# EAGLE design tello-charger (EAGLE 9.6.2)
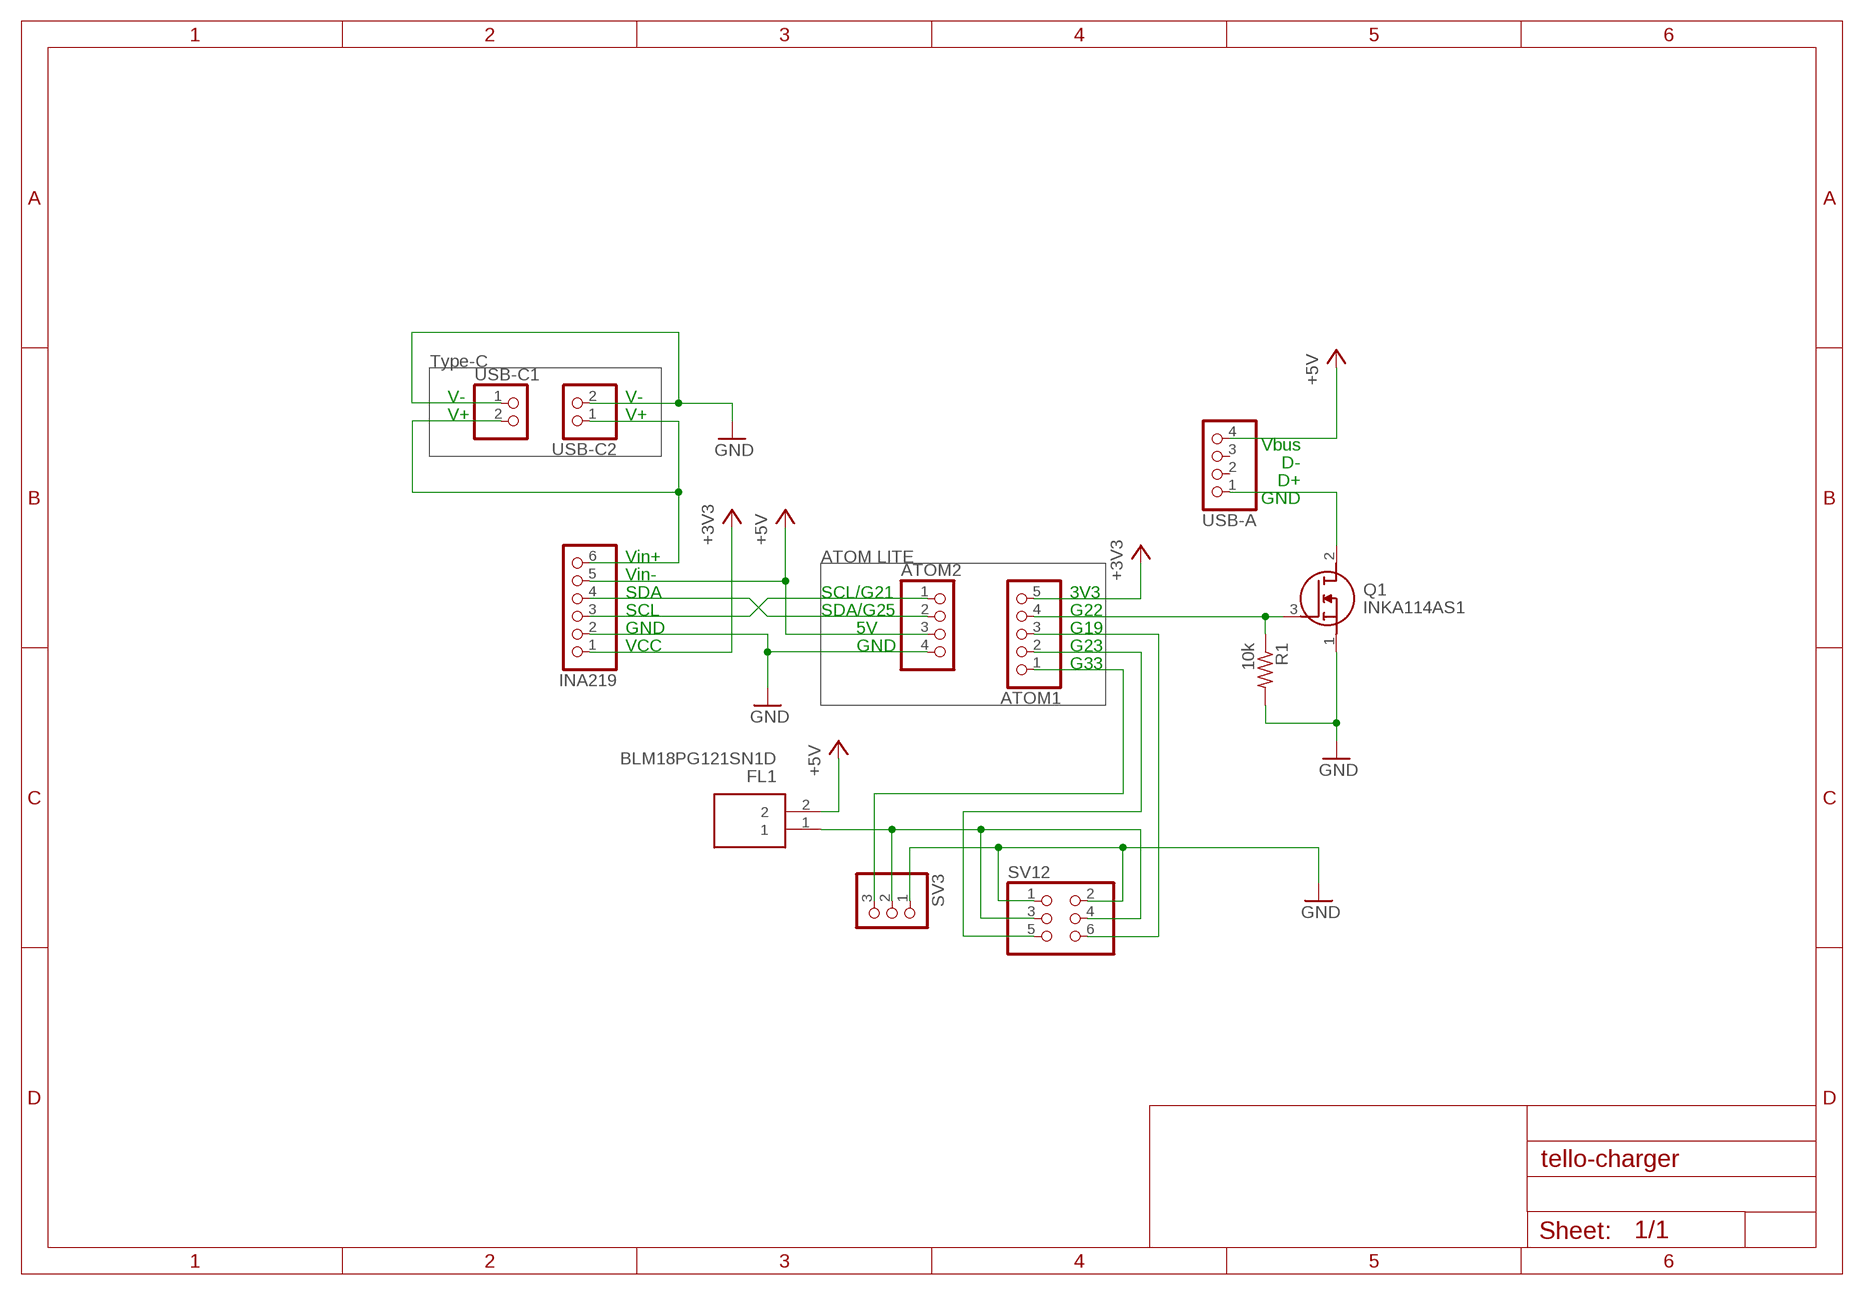
[diagram p0: schematic, sheet 1]

## Parts
ATOM1  PINHD-1X5  [1X05]
ATOM2  PINHD-1X4  [1X04]
FL1  BLM18PG121SN1D  [BLM18AG102BH1D]
INA219  PINHD-1X6  [1X06]
Q1  INKA114AS1  [INKA114AS1]
R1  10k  R-US_R0603  [R0603]
SV3  PINHD-1X3/90  [1X03/90]
SV12  PINHD-2X3/90  [2X03/90]
USB-A  PINHD-1X4  [1X04]
USB-C1  PINHD-1X2  [1X02]
USB-C2  PINHD-1X2  [1X02]

## Nets
+3V3 [POWER]: ATOM1.5 INA219.1
+5V [POWER]: ATOM2.3 FL1.2 INA219.5 USB-A.4
GND [POWER]: ATOM2.4 INA219.2 Q1.1(S) R1.2 SV3.1 SV12.1 SV12.2 USB-C1.1 USB-C2.2
N$1: INA219.6 USB-C1.2 USB-C2.1
N$2: Q1.2(D) USB-A.1
N$3: ATOM2.2 INA219.4
N$4: ATOM2.1 INA219.3
N$5: ATOM1.2 SV12.5
N$6: ATOM1.4 Q1.3(G) R1.1
N$7: FL1.1 SV3.2 SV12.3 SV12.4
N$8: ATOM1.3 SV12.6
N$9: ATOM1.1 SV3.3
Unconnected: USB-A.2 USB-A.3

## Notes on the sheet
- Type-C
- V- | V-
- V+ | V+
- Vbus
- D-
- D+
- GND
- Vin+ | ATOM LITE
- Vin-
- SDA | SCL/G21 | 3V3
- SCL | SDA/G25 | G22
- GND | 5V | G19
- VCC | GND | G23
- G33

## Library data of the parts
ATOM1 = pinhead:PINHD-1X5: PIN HEADER
ATOM2 USB-A = pinhead:PINHD-1X4: PIN HEADER
FL1 = SamacSys_Parts:BLM18PG121SN1D: Ferrite bead SMD 0603 120R 2A Murata Ferrite Bead (Chip Ferrite Bead), 1.6 x 0.8 x 0.8mm (0603), 120 impedance at 100 MHz Source: Datasheet <https://www.murata.com/en-us/products/productdetail?partno=BLM18PG121SN1#>; ARROW_PART_NUMBER: BLM18PG121SN1D; ARROW_PRICE-STOCK: https://www.arrow.com/en/products/blm18pg121sn1d/murata-manufacturing?region=nac; DESCRIPTION: Ferrite bead SMD 0603 120R 2A Murata Ferrite Bead (Chip Ferrite Bead), 1.6 x 0.8 x 0.8mm (0603), 120 impedance at 100 MHz; HEIGHT: 0.95mm; MANUFACTURER_NAME: Murata Electronics; MANUFACTURER_PART_NUMBER: BLM18PG121SN1D; MOUSER_PART_NUMBER: 81-BLM18PG121SN1D; MOUSER_PRICE-STOCK: https://www.mouser.co.uk/ProductDetail/Murata-Electronics/BLM18PG121SN1D?qs=tY8e8KZalarVxhnmnUYZ1A%3D%3D
INA219 = pinhead:PINHD-1X6: PIN HEADER
Q1 = SamacSys_Parts:INKA114AS1: Active clamp, Silicon N channel MOS type Source: Datasheet <https://www.idc-com.co.jp/product/Search/Pdf/en/8/INKA114AS1/0/>; DESCRIPTION: Active clamp, Silicon N channel MOS type; HEIGHT: 3mm; MANUFACTURER_NAME: ISAHAYA ELECTRONICS CORPORATION; MANUFACTURER_PART_NUMBER: INKA114AS1
R1 = rcl:R-US_: RESISTOR, American symbol; SPICEPREFIX: R
SV3 = pinhead:PINHD-1X3: PIN HEADER
SV12 = pinhead:PINHD-2X3: PIN HEADER
USB-C1 USB-C2 = pinhead:PINHD-1X2: PIN HEADER

## Net classes
1 POWER: width 0.508 mm

## Board
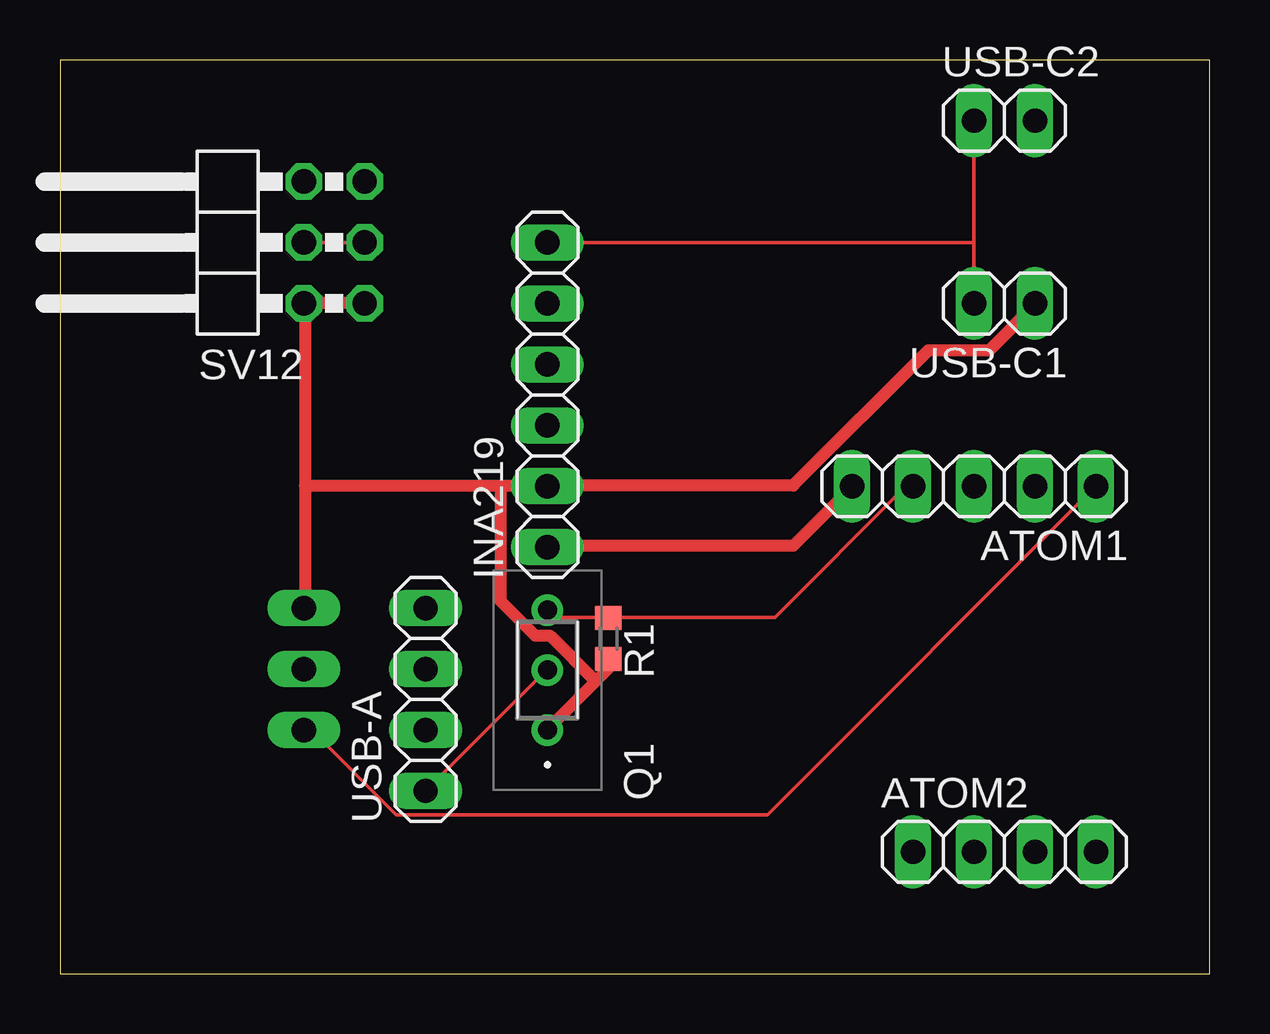
[diagram p1: board, top side]
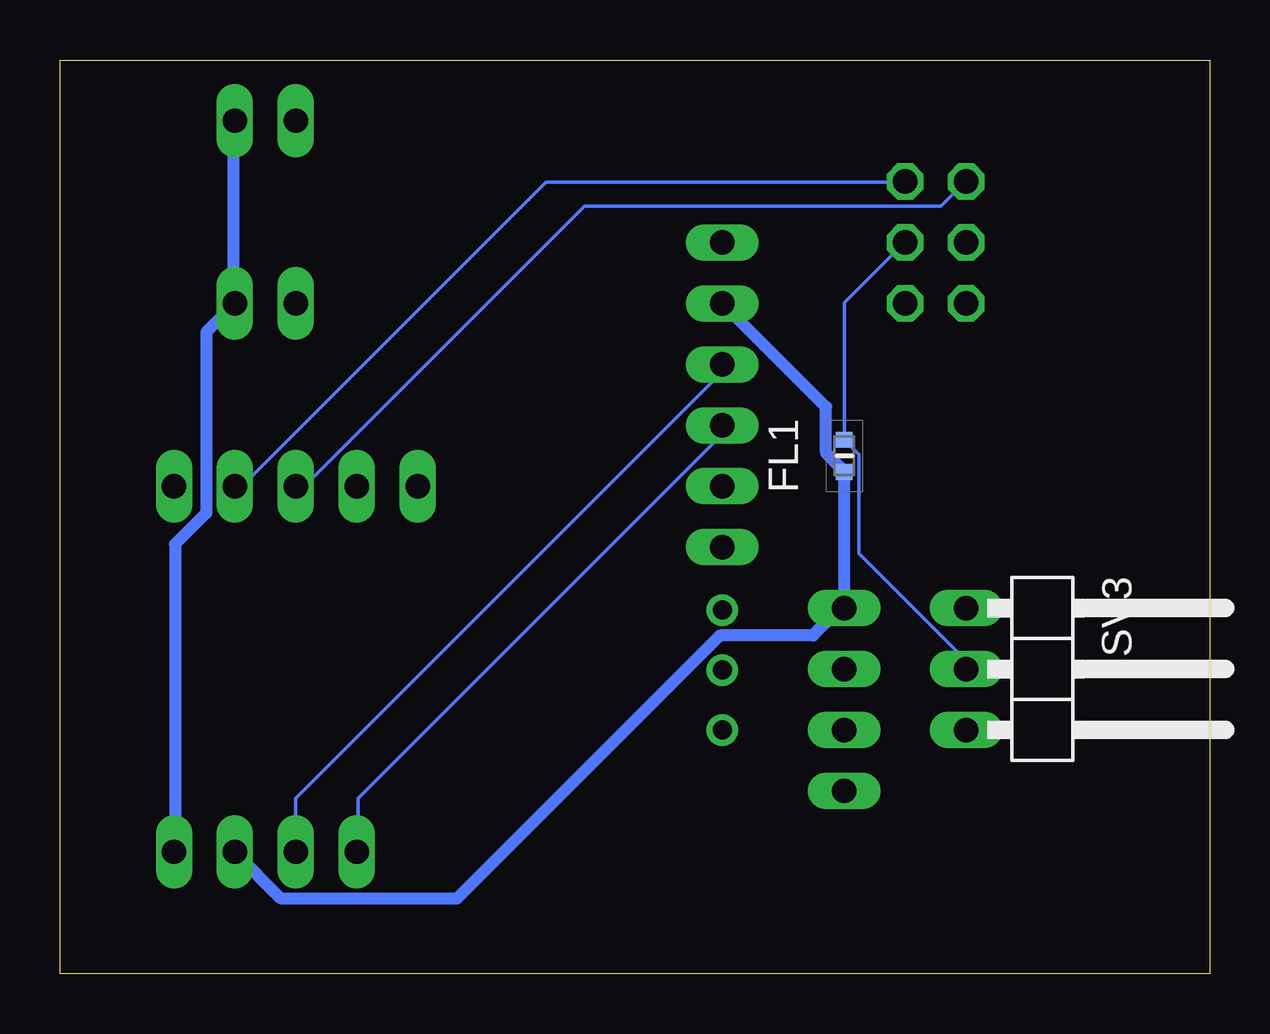
[diagram p2: board, bottom side, seen from below]

Size 47.93 x 38.09 mm. Coordinates in mm from the lower left corner, seen from the top.
Outline: 0,0 47.93,0 47.93,38.09 0,38.09 0,0
Copper layers (1*16): Top 0.035mm / dielectric 1.5mm / Bottom 0.035mm
Design rules "default": minimum track width 6mil, minimum drill 0.35mm, track to track 6mil, track to pad 6mil, pad to pad 6mil, via to via 6mil, smd to smd 6mil, copper to edge 40mil, drill to drill 6mil, minimum pad ring 10mil, minimum via ring 8mil, stop-mask expansion 4mil, vias tented up to drill 0mil, thermal gap 10mil

### Footprints (pad centres in the part's own frame; a part is rotated, then mirrored left to right if it is on the bottom)
1X05 = drill 1.016 long: 1 -5.08,0; 2 -2.54,0; 3 0,0; 4 2.54,0; 5 5.08,0
1X04 = drill 1.016 long: 1 -3.81,0; 2 -1.27,0; 3 1.27,0; 4 3.81,0
BLM18AG102BH1D = smd 0.65 x 0.7: 1 -0.675,0; 2 0.675,0
1X06 = drill 1.016 long: 1 -6.35,0; 2 -3.81,0; 3 -1.27,0; 4 1.27,0; 5 3.81,0; 6 6.35,0
INKA114AS1 = drill 0.8 pad 1.3: 1 0,0; 2 2.5,0; 3 5,0
R0603 = smd 1 x 1.1: 1 -0.85,0; 2 0.85,0
1X03/90 = drill 1.016 long: 1 -2.54,-3.81; 2 0,-3.81; 3 2.54,-3.81
2X03/90 = drill 1.016 octagon: 1 -2.54,-6.35; 2 -2.54,-3.81; 3 0,-6.35; 4 0,-3.81; 5 2.54,-6.35; 6 2.54,-3.81
1X02 = drill 1.016 long: 1 -1.27,0; 2 1.27,0

### Placement (x,y rotation side)
ATOM1  38.1,20.32 180 top
ATOM2  39.37,5.08 0 top
FL1  15.24,21.59 270 bottom
INA219  20.32,24.13 90 top
Q1  20.32,10.16 90 top
R1  22.86,13.97 270 top
SV3  6.35,12.7 270 bottom
SV12  6.35,30.48 90 top
USB-A  15.24,11.43 90 top
USB-C1  39.37,27.94 180 top
USB-C2  39.37,35.56 0 top

### Tracks (layer width: path | path; a pad name or v marks a point on that pad's centre or on a via)
+3V3
  Top 0.508: INA219.1 20.34,17.83 30.56,17.83 32.99,20.27 ATOM1.5
+5V
  Bottom 0.508: ATOM2.3 40.62,5.03 38.71,3.12 31.39,3.12 20.42,14.1 16.54,14.1 15.47,15.16 USB-A.4 FL1.2 15.39,21.11 16,21.72 16,23.62 INA219.5
GND
  Top 0.508: R1.2 22.86,12.72 22.33,12.19 | 22.33,12.19 20.34,10.21 Q1.1 | 10.21,20.34 10.21,27.89 SV12.2 10.44,27.96 12.65,27.96 SV12.1 | 10.21,20.34 10.21,15.24 SV3.1 | 10.21,20.34 18.36,20.34 | 18.36,20.34 20.27,20.34 INA219.2 20.57,20.34 30.56,20.34 36.2,25.98 38.71,25.98 40.62,27.89 USB-C1.1 | 22.33,12.19 20.42,14.1 19.81,14.1 18.36,15.54 18.36,20.34
  Bottom 0.508: ATOM2.4 43.13,5.11 43.13,17.91 41.83,19.2 41.83,26.75 USB-C1.1 40.69,28.12 40.69,35.51 USB-C2.2
N$1
  Top 0.152: USB-C2.1 38.1,30.48 | 38.1,30.48 USB-C1.2 | 38.1,30.48 INA219.6
N$2
  Top 0.152: USB-A.1 20.27,12.65 Q1.2
N$3
  Bottom 0.152: ATOM2.2 38.1,7.32 20.34,25.07 20.34,25.38 INA219.4
N$4
  Bottom 0.152: INA219.3 20.34,22.86 20.34,22.48 35.51,7.32 35.51,5.11 ATOM2.1
N$5
  Bottom 0.152: ATOM1.2 40.62,20.34 40.31,20.34 27.66,32.99 12.72,32.99 SV12.5
N$6
  Top 0.152: 22.86,14.86 20.57,14.86 20.34,15.09 Q1.3 | 22.86,14.86 29.79,14.86 35.2,20.27 35.51,20.27 ATOM1.4 | 22.86,14.86 R1.1
N$7
  Top 0.152: SV12.3 SV12.4
  Bottom 0.152: SV12.3 12.72,30.48 15.24,27.96 FL1.1 15.24,22.25 14.63,21.64 14.63,17.53 10.21,13.11 10.21,12.72 SV3.2
N$8
  Bottom 0.152: ATOM1.3 38.1,20.34 37.72,20.34 26.06,32 11.2,32 10.21,32.99 SV12.6
N$9
  Top 0.152: ATOM1.1 29.49,6.63 14.02,6.63 10.52,10.13 10.21,10.13 SV3.3